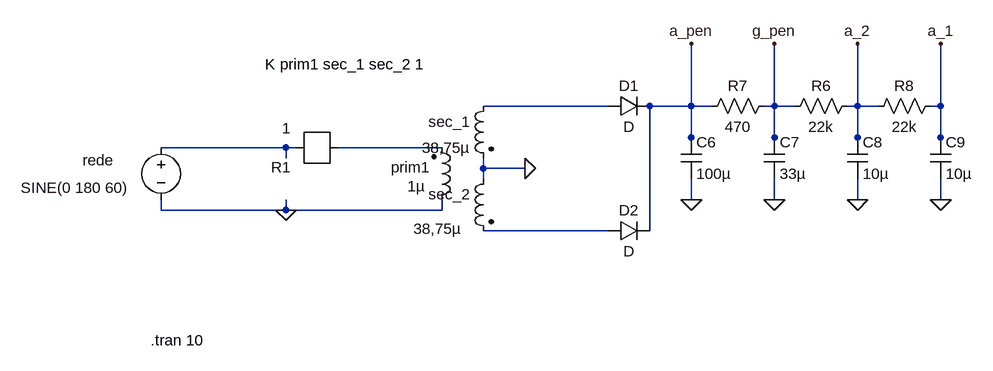
[diagram p0: schematic fonte vox ac4tv.asc]
fonte vox ac4tv.asc, the LTspice schematic file:
Version 4
SHEET 1 920 1208
WIRE 336 816 144 816
WIRE 464 816 464 720
WIRE 464 816 400 816
WIRE 496 816 464 816
WIRE 592 816 592 720
WIRE 592 816 576 816
WIRE 624 816 592 816
WIRE 720 816 720 720
WIRE 720 816 704 816
WIRE 752 816 720 816
WIRE 848 816 848 720
WIRE 848 816 832 816
WIRE 464 864 464 816
WIRE 592 864 592 816
WIRE 720 864 720 816
WIRE 848 864 848 816
WIRE -160 880 -352 880
WIRE -144 880 -160 880
WIRE 80 880 -80 880
WIRE 464 880 464 864
WIRE 592 880 592 864
WIRE 720 880 720 864
WIRE 848 880 848 864
WIRE -160 896 -160 880
WIRE 144 912 144 896
WIRE 208 912 144 912
WIRE 144 928 144 912
WIRE 464 960 464 928
WIRE 592 960 592 928
WIRE 720 960 720 928
WIRE 848 960 848 928
WIRE -352 976 -352 960
WIRE -160 976 -160 960
WIRE -160 976 -352 976
WIRE 80 976 80 960
WIRE 80 976 -160 976
WIRE 336 1008 144 1008
WIRE 400 1008 400 816
FLAG 464 960 0
FLAG 592 960 0
FLAG 720 960 0
FLAG 848 960 0
FLAG 208 912 0
FLAG 848 720 a_1
FLAG 720 720 a_2
FLAG 592 720 g_pen
FLAG 464 720 a_pen
FLAG -160 976 0
SYMBOL res 720 800 R90
WINDOW 0 0 56 VBottom 2
WINDOW 3 32 56 VTop 2
SYMATTR InstName R6
SYMATTR Value 22k
SYMBOL res 592 800 R90
WINDOW 0 0 56 VBottom 2
WINDOW 3 32 56 VTop 2
SYMATTR InstName R7
SYMATTR Value 470
SYMBOL res 848 800 R90
WINDOW 0 0 56 VBottom 2
WINDOW 3 32 56 VTop 2
SYMATTR InstName R8
SYMATTR Value 22k
SYMBOL cap 448 864 R0
SYMATTR InstName C6
SYMATTR Value 100µ
SYMBOL cap 576 864 R0
SYMATTR InstName C7
SYMATTR Value 33µ
SYMBOL cap 704 864 R0
SYMATTR InstName C8
SYMATTR Value 10µ
SYMBOL cap 832 864 R0
SYMATTR InstName C9
SYMATTR Value 10µ
SYMBOL diode 336 832 R270
WINDOW 0 32 32 VTop 2
WINDOW 3 0 32 VBottom 2
SYMATTR InstName D1
SYMBOL diode 336 1024 R270
WINDOW 0 32 32 VTop 2
WINDOW 3 0 32 VBottom 2
SYMATTR InstName D2
SYMBOL ind2 160 800 M0
SYMATTR InstName sec_1
SYMATTR Value 38,75µ
SYMATTR Type ind
SYMBOL ind2 64 976 M180
WINDOW 0 -62 66 Left 2
WINDOW 3 -37 37 Left 2
SYMATTR InstName prim1
SYMATTR Value 1µ
SYMATTR Type ind
SYMBOL ind2 160 912 M0
WINDOW 3 49 93 Left 2
SYMATTR Value 38,75µ
SYMATTR InstName sec_2
SYMATTR Type ind
SYMBOL voltage -352 864 R0
WINDOW 0 -121 35 Left 2
WINDOW 3 -216 78 Left 2
SYMATTR InstName rede
SYMATTR Value SINE(0 180 60)
SYMATTR Value2 AC 180
SYMBOL r -80 880 R180
SYMATTR InstName R1
SYMATTR Value 1
TEXT -192 752 Left 2 !K prim1 sec_1 sec_2 1
TEXT -368 1176 Left 2 !.tran 10

The netlist it stands for:
* fonte vox ac4tv.asc
R6 a_2 g_pen 22k
R7 g_pen a_pen 470
R8 a_1 a_2 22k
C6 a_pen 0 100µ
C7 g_pen 0 33µ
C8 a_2 0 10µ
C9 a_1 0 10µ
D1 N001 a_pen D
D2 N004 a_pen D
L§sec_1 N001 0 38,75µ
L§prim1 0 N003 1µ
L§sec_2 0 N004 38,75µ
V§rede N002 0 SINE(0 180 60) AC 180
R1 N002 N003 1
.model D D
.lib standard.dio
K prim1 sec_1 sec_2 1
.tran 10
.backanno
.end